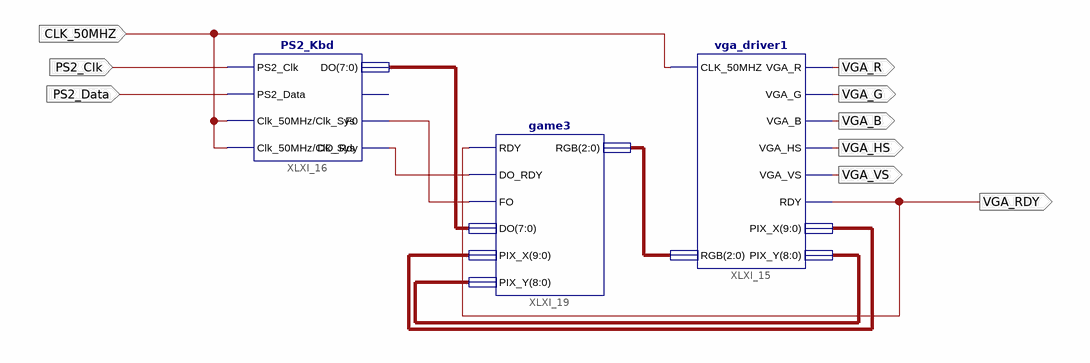
[diagram p0: schematic sheet 1]
// Xilinx ISE schematic vga.sch (spartan3e) as structural Verilog: 3 symbols, 9 ports
module vga (
  input  CLK_50MHZ,
  input  PS2_Clk,
  input  PS2_Data,
  output VGA_R,
  output VGA_G,
  output VGA_B,
  output VGA_HS,
  output VGA_VS,
  output VGA_RDY
);

  wire XLXN_24, XLXN_26;
  wire [2:0] XLXN_1;
  wire [7:0] XLXN_18;
  wire [8:0] XLXN_2;
  wire [9:0] XLXN_3;

  vga_driver1 XLXI_15 (
    .CLK_50MHZ(CLK_50MHZ), .RGB(XLXN_1), .VGA_R(VGA_R), .VGA_G(VGA_G), .VGA_B(VGA_B), .VGA_HS(VGA_HS),
    .VGA_VS(VGA_VS), .RDY(VGA_RDY), .PIX_X(XLXN_3), .PIX_Y(XLXN_2));
  PS2_Kbd XLXI_16 (
    .PS2_Clk(PS2_Clk), .PS2_Data(PS2_Data), .Clk_50MHz(CLK_50MHZ), .F0(XLXN_24), .DO_Rdy(XLXN_26),
    .DO(XLXN_18), .Clk_Sys(CLK_50MHZ));  // open: E0
  game3 XLXI_19 (
    .RDY(VGA_RDY), .DO_RDY(XLXN_26), .FO(XLXN_24), .DO(XLXN_18), .PIX_X(XLXN_3), .PIX_Y(XLXN_2), .RGB(XLXN_1));
endmodule
